# EAGLE design Buffer_VCA (EAGLE 7.6.0)
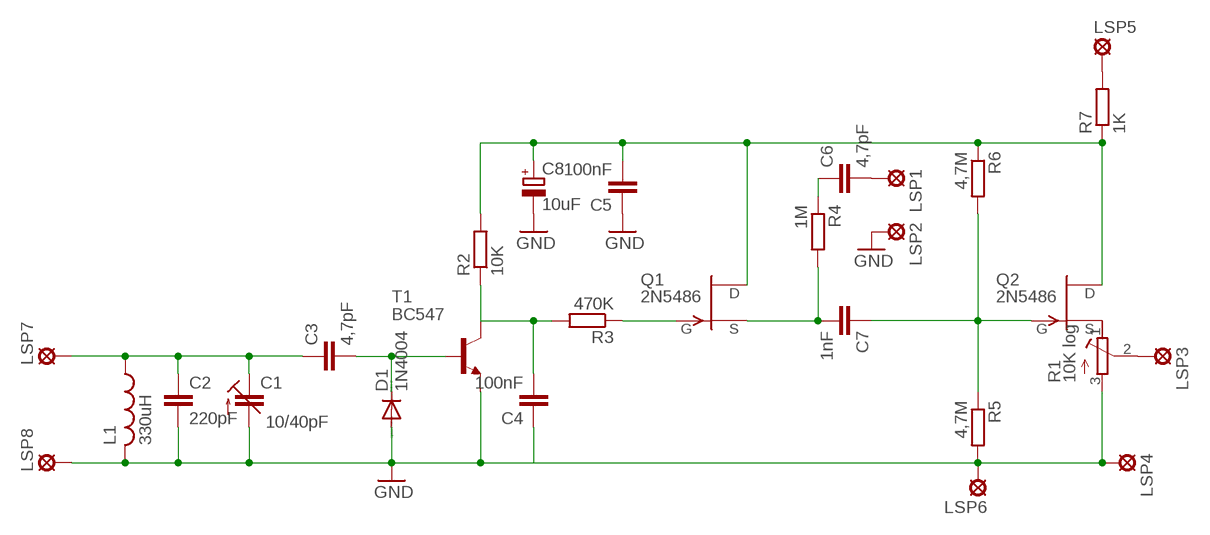
[diagram p0: schematic, sheet 1]

## Parts
C1  10/40pF  C-TRIMM808  [CTRIM808-BC]
C2  220pF  C-EU050-024X044  [C050-024X044]
C3  4,7pF  C-EU050-024X044  [C050-024X044]
C4  100nF  C-EU050-024X044  [C050-024X044]
C5  100nF  C-EU050-024X044  [C050-024X044]
C6  4,7pF  C-EU050-024X044  [C050-024X044]
C7  1nF  C-EU050-024X044  [C050-024X044]
C8  10uF  CPOL-EUE3.5-10  [E3,5-10]
D1  1N4004  [DO41-10]
L1  330uH  L-US0204/7  [0204/7]
LSP1  LSP10  [LSP10]
LSP2  LSP10  [LSP10]
LSP3  LSP10  [LSP10]
LSP4  LSP10  [LSP10]
LSP5  LSP10  [LSP10]
LSP6  LSP10  [LSP10]
LSP7  LSP10  [LSP10]
LSP8  LSP10  [LSP10]
Q1  2N5486  [TO92-]
Q2  2N5486  [TO92-]
R1  10K log  R-TRIMMT93XB  [RTRIMT93XB]
R2  10K  R-EU_0207/10  [0207/10]
R3  470K  R-EU_0207/10  [0207/10]
R4  1M  R-EU_0207/10  [0207/10]
R5  4,7M  R-EU_0207/10  [0207/10]
R6  4,7M  R-EU_0207/10  [0207/10]
R7  1K  R-EU_0207/10  [0207/10]
T1  BC547  [TO92]

## Nets
N$1: C1.1(E) C2.1 C3.1 L1.1 LSP7.MP
N$2: C6.2 LSP1.MP
N$3: C3.2 D1.C T1.2(B)
N$4: C4.2 R2.1 R3.2 T1.3(C)
N$5: C5.2 C8.+ Q1.3(D) Q2.3(D) R2.2 R6.1 R7.1
N$6: Q1.1(G) R3.1
N$7: C6.1 R4.1
N$8: C7.2 Q1.2(S) R4.2
N$9: C7.1 Q2.1(G) R5.1 R6.2
N$10: Q2.2(S) R1.1(E)
N$11: LSP3.MP R1.2(S)
N$12: LSP5.MP R7.2
N$16: C1.2(A) C2.2 C4.1 C5.1 C8.- D1.A L1.2 LSP2.MP LSP4.MP LSP6.MP LSP8.MP R1.3(A) R5.2 T1.1(E) ; supply symbol labelled GND

## Library data of the parts
C1 = rcl:C-TRIMM: Trimm capacitor
C2-C7 = rcl:C-EU: CAPACITOR, European symbol
C8 = rcl:CPOL-EU: POLARIZED CAPACITOR, European symbol
D1 = diode:1N4004: DIODE general purpose rectifier, 1 A
L1 = rcl:L-US: INDUCTOR, American symbol
LSP1-LSP8 = solpad:LSP10: SOLDER PAD drill 1.0 mm, distributor Buerklin, 12H555
Q1 Q2 = transistor-fet:?548*: N-Channel JFETs Source: VISHAY 2N5484.pdf Compatible: TO92 2N5245 J304 J305 U310 J308 J309 J310 TO72 2N4416 2N4416A 2N3823 2N4351 3N169 3N170 3N171 MFE3002 TO18 2N3796 2N3797 MFE825 Source: Motorola European Master Guide Pacge 3-59
R1 = resistor:R-TRIMM: Trimm resistor
R2-R7 = resistor:R-EU_: RESISTOR, European symbol
T1 = transistor:BC547: NPN TRANSISTOR

## Board
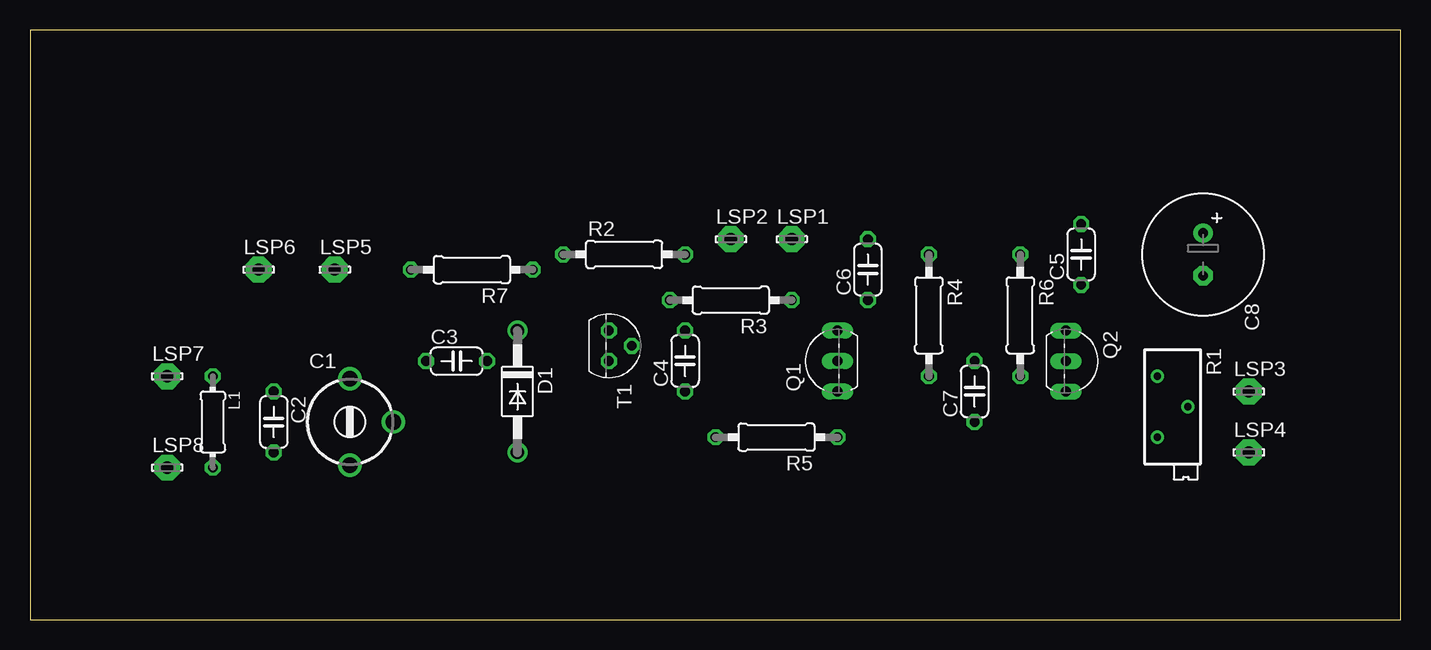
[diagram p1: board, top side]
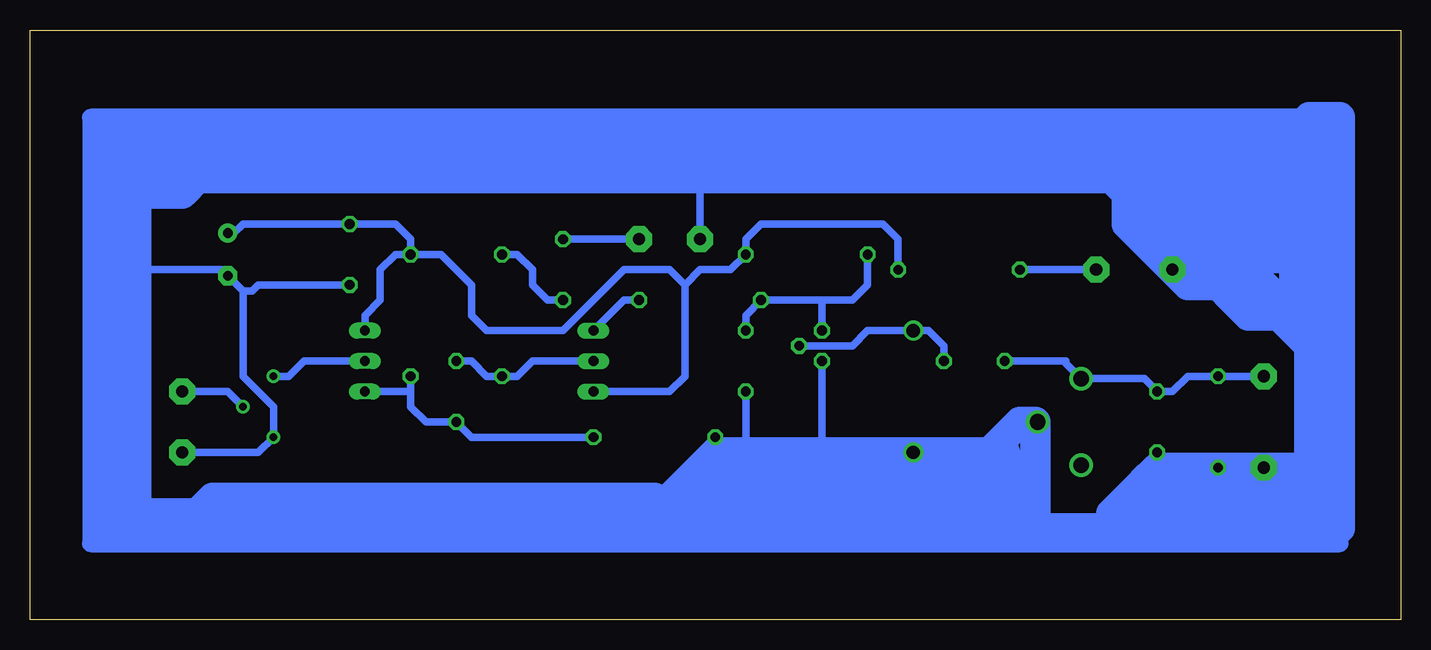
[diagram p2: board, bottom side, seen from below]

Size 114.28 x 49.2 mm. Coordinates in mm from the lower left corner, seen from the top.
Outline: 0,0 114.28,0 114.28,49.2 0,49.2 0,0
Copper layers (1*16): Top 0.035mm / dielectric 1.5mm / Bottom 0.035mm
Design rules "default": minimum track width 10mil, minimum drill 24mil, track to track 8mil, track to pad 8mil, pad to pad 8mil, via to via 8mil, smd to smd 8mil, copper to edge 40mil, drill to drill 8mil, minimum pad ring 10mil, minimum via ring 8mil, stop-mask expansion 4mil, vias tented up to drill 0mil, thermal gap 10mil

### Footprints (pad centres in the part's own frame; a part is rotated, then mirrored left to right if it is on the bottom)
CTRIM808-BC = drill 1.3: 1 -3.607,0; 2 0,3.607; 3 3.607,0
C050-024X044 = drill 0.813 octagon: 1 -2.54,0; 2 2.54,0
E3,5-10 = drill 0.813 pad 1.6: + -1.778,0 | drill 0.813 pad 1.6 octagon: - 1.778,0
DO41-10 = drill 1.118: A 5.08,0; C -5.08,0
0204/7 = drill 0.813 octagon: 1 -3.81,0; 2 3.81,0
LSP10 = drill 1.016 pad 2.159 octagon: MP 0,0
TO92- = drill 0.813 long: 1 2.54,0; 2 0,0; 3 -2.54,0
RTRIMT93XB = drill 0.61: 1 1.27,-2.54; 2 -1.27,0; 3 1.27,2.54
0207/10 = drill 0.813 octagon: 1 -5.08,0; 2 5.08,0
TO92 = drill 0.813 octagon: 1 1.27,0; 2 0,1.905; 3 -1.27,0

### Placement (x,y rotation side)
C1  26.67,16.51 270 top
C2  20.32,16.51 270 top
C3  35.56,21.59 0 top
C4  54.61,21.59 90 top
C5  87.63,30.48 90 top
C6  69.85,29.21 90 top
C7  78.74,19.05 90 top
C8  97.79,30.48 270 top
D1  40.64,19.05 270 top
L1  15.24,16.51 270 top
LSP1  63.5,31.75 0 top
LSP2  58.42,31.75 0 top
LSP3  101.6,19.05 0 top
LSP4  101.6,13.97 0 top
LSP5  25.4,29.21 0 top
LSP6  19.05,29.21 0 top
LSP7  11.43,20.32 0 top
LSP8  11.43,12.7 0 top
Q1  67.31,21.59 90 top
Q2  86.36,21.59 270 top
R1  95.25,17.78 180 top
R2  49.53,30.48 0 top
R3  58.42,26.67 180 top
R4  74.93,25.4 270 top
R5  62.23,15.24 180 top
R6  82.55,25.4 270 top
R7  36.83,29.21 180 top
T1  48.26,22.86 270 top

### Tracks (layer width: path | path; a pad name or v marks a point on that pad's centre or on a via)
N$1
  Bottom 0.61: LSP7.MP L1.1 17.78,20.32 19.05,19.05 C2.1 21.39,20.12 C1.1 27.94,21.39 27.94,21.59 C3.1
N$2
  Bottom 0.61: LSP1.MP C6.2
N$3
  Bottom 0.61: C3.2 38.1,22.86 39.37,24.13 D1.C 44.45,24.13 45.72,22.86 T1.2
N$4
  Bottom 0.61: R2.1 44.45,27.94 45.72,26.67 48.26,26.67 | 48.26,26.67 T1.3 | 48.26,26.67 R3.2 54.61,25.4 C4.2
N$5
  Bottom 0.61: R7.1 41.91,31.75 43.18,33.02 53.34,33.02 54.61,31.75 R2.2 55.88,29.21 58.42,29.21 59.69,27.94 | C8.+ 97.28,32.26 96.52,33.02 C5.2 83.82,33.02 82.55,31.75 R6.1 | Q2.3 86.36,25.4 85.09,26.67 85.09,29.21 83.82,30.48 R6.1 | 59.69,27.94 59.69,20.32 60.96,19.05 Q1.3 | R6.1 80.01,30.48 77.47,27.94 77.47,25.4 76.2,24.13 69.85,24.13 64.77,29.21 60.96,29.21 59.69,27.94
N$6
  Bottom 0.61: R3.1 64.77,26.67 Q1.1
N$7
  Bottom 0.61: C6.1 71.12,26.67 72.39,27.94 72.39,29.21 73.66,30.48 R4.1
N$8
  Bottom 0.61: Q1.2 72.39,21.59 73.66,20.32 R4.2 76.2,20.32 77.47,21.59 C7.2
N$9
  Bottom 0.61: R5.1 77.47,15.24 C7.1 81.28,16.51 82.55,17.78 82.55,19.05 | 82.55,19.05 R6.2 | Q2.1 82.55,19.05
N$10
  Bottom 0.61: Q2.2 91.44,21.59 92.71,20.32 R1.1
N$11
  Bottom 0.61: R1.2 97.79,19.05 LSP3.MP
N$12
  Bottom 0.61: LSP5.MP R7.2
N$16
  Bottom 0.61: LSP8.MP L1.2 15.24,6.35 | C2.2 20.32,12.7 20.32,6.35 | C1.2 30.48,16.31 30.48,8.89 30.48,6.35 | 20.32,6.35 30.48,6.35 | 15.24,6.35 20.32,6.35 | D1.A 40.64,6.35 | T1.1 48.26,6.35 | R5.2 57.15,13.97 57.15,6.35 54.61,6.35 | LSP4.MP 95.25,13.97 R1.3 93.98,17.78 96.52,20.32 96.52,27.43 | 96.52,27.43 C8.- 98.3,29.21 109.22,29.21 109.22,41.91 58.42,41.91 | LSP6.MP 8.89,29.21 5.08,29.21 | 5.08,29.21 5.08,7.62 | 5.08,6.35 15.24,6.35 | C5.1 95.25,27.94 95.76,27.43 96.52,27.43 | C4.1 54.61,6.35 | 54.61,6.35 48.26,6.35 | 48.26,6.35 40.64,6.35 | 40.64,6.35 30.48,6.35 | LSP2.MP 58.42,41.91 | 58.42,41.91 5.08,41.91 5.08,29.21
  Bottom 1.422: 5.08,41.91 109.22,41.91 109.22,6.35 5.08,6.35 5.08,7.62
  Bottom 2.54: 62.23,10.16 99.06,10.16 100.33,8.89 105.41,8.89 | 20.32,38.1 105.41,38.1 | 105.41,38.1 106.68,38.1 | 106.68,31.75 105.41,33.02 | 105.41,33.02 105.41,38.1 | 6.35,40.64 107.95,40.64 107.95,7.62 105.41,7.62 | 105.41,7.62 64.77,7.62 | 64.77,7.62 7.62,7.62 | 7.62,7.62 5.08,7.62 5.08,41.91 7.62,41.91 7.62,22.86 | 7.62,22.86 7.62,7.62 | LSP6.MP 19.05,38.1 | 19.05,38.1 19.05,39.37 | 19.05,38.1 8.89,38.1 8.89,30.48 17.78,30.48 17.78,35.56 10.16,35.56 10.16,33.02 16.51,33.02 | 105.41,33.02 105.41,8.89 | 105.41,8.89 105.41,7.62 | 64.77,7.62 63.5,8.89 62.23,8.89 57.15,13.97 D1.A 34.29,13.97 31.75,16.51 30.48,16.51 30.48,8.89 59.69,8.89 58.42,10.16 58.42,11.43 31.75,11.43 33.02,12.7 33.02,13.97 | 8.89,12.7 20.32,12.7 21.59,11.43 | 21.59,11.43 24.13,8.89 8.89,8.89 8.89,11.43 21.59,11.43 | 7.62,22.86 10.16,25.4 12.7,25.4 16.51,29.21 LSP6.MP | LSP6.MP 17.78,27.94 11.43,27.94 10.16,26.67 8.89,26.67 8.89,29.21 | LSP6.MP 22.86,33.02 22.86,36.83 20.32,36.83 20.32,33.02 24.13,36.83 100.33,36.83 101.6,35.56 104.14,35.56